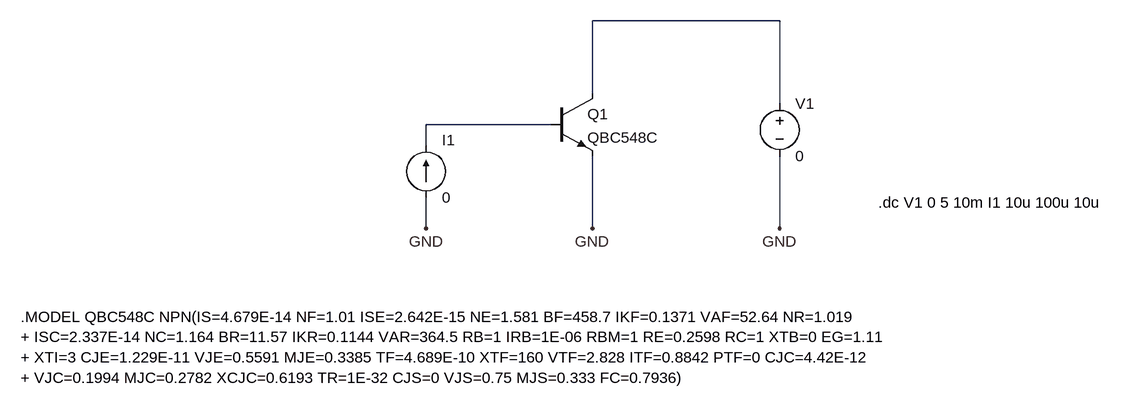
[diagram p0: schematic xisitor.asc]
xisitor.asc, the LTspice schematic file:
Version 4
SHEET 1 1808 1276
WIRE 192 1040 192 928
WIRE 192 832 192 720
WIRE 192 720 480 720
WIRE 480 720 480 848
WIRE 480 928 480 1040
WIRE -64 1040 -64 992
WIRE -64 912 -64 880
WIRE -64 880 128 880
FLAG 480 1040 GND
FLAG 192 1040 GND
FLAG -64 1040 GND
SYMBOL npn 128 832 R0
SYMATTR InstName Q1
SYMATTR Value QBC548C
SYMBOL voltage 480 832 R0
SYMATTR InstName V1
SYMATTR Value 0
SYMBOL current -64 992 M180
WINDOW 0 24 88 Left 0
WINDOW 3 24 0 Left 0
SYMATTR InstName I1
SYMATTR Value 0
text -688 1176 Left 0 !.MODEL QBC548C NPN(IS=4.679E-14 NF=1.01 ISE=2.642E-15 NE=1.581 BF=458.7 IKF=0.1371 VAF=52.64 NR=1.019\n+ ISC=2.337E-14 NC=1.164 BR=11.57 IKR=0.1144 VAR=364.5 RB=1 IRB=1E-06 RBM=1 RE=0.2598 RC=1 XTB=0 EG=1.11\n+ XTI=3 CJE=1.229E-11 VJE=0.5591 MJE=0.3385 TF=4.689E-10 XTF=160 VTF=2.828 ITF=0.8842 PTF=0 CJC=4.42E-12\n+ VJC=0.1994 MJC=0.2782 XCJC=0.6193 TR=1E-32 CJS=0 VJS=0.75 MJS=0.333 FC=0.7936)
text 632 1000 Left 0 !.dc V1 0 5 10m I1 10u 100u 10u

The netlist it stands for:
* xisitor.asc
Q1 N001 N002 GND 0 QBC548C
V1 N001 GND 0
I1 GND N002 0
.model NPN NPN
.model PNP PNP
.lib standard.bjt
.MODEL QBC548C NPN(IS=4.679E-14 NF=1.01 ISE=2.642E-15 NE=1.581 BF=458.7 IKF=0.1371 VAF=52.64 NR=1.019
+ ISC=2.337E-14 NC=1.164 BR=11.57 IKR=0.1144 VAR=364.5 RB=1 IRB=1E-06 RBM=1 RE=0.2598 RC=1 XTB=0 EG=1.11
+ XTI=3 CJE=1.229E-11 VJE=0.5591 MJE=0.3385 TF=4.689E-10 XTF=160 VTF=2.828 ITF=0.8842 PTF=0 CJC=4.42E-12
+ VJC=0.1994 MJC=0.2782 XCJC=0.6193 TR=1E-32 CJS=0 VJS=0.75 MJS=0.333 FC=0.7936)
.dc V1 0 5 10m I1 10u 100u 10u
.backanno
.end